# Altium schematic sheet 1_BlockDiagram.SchDoc
size A3
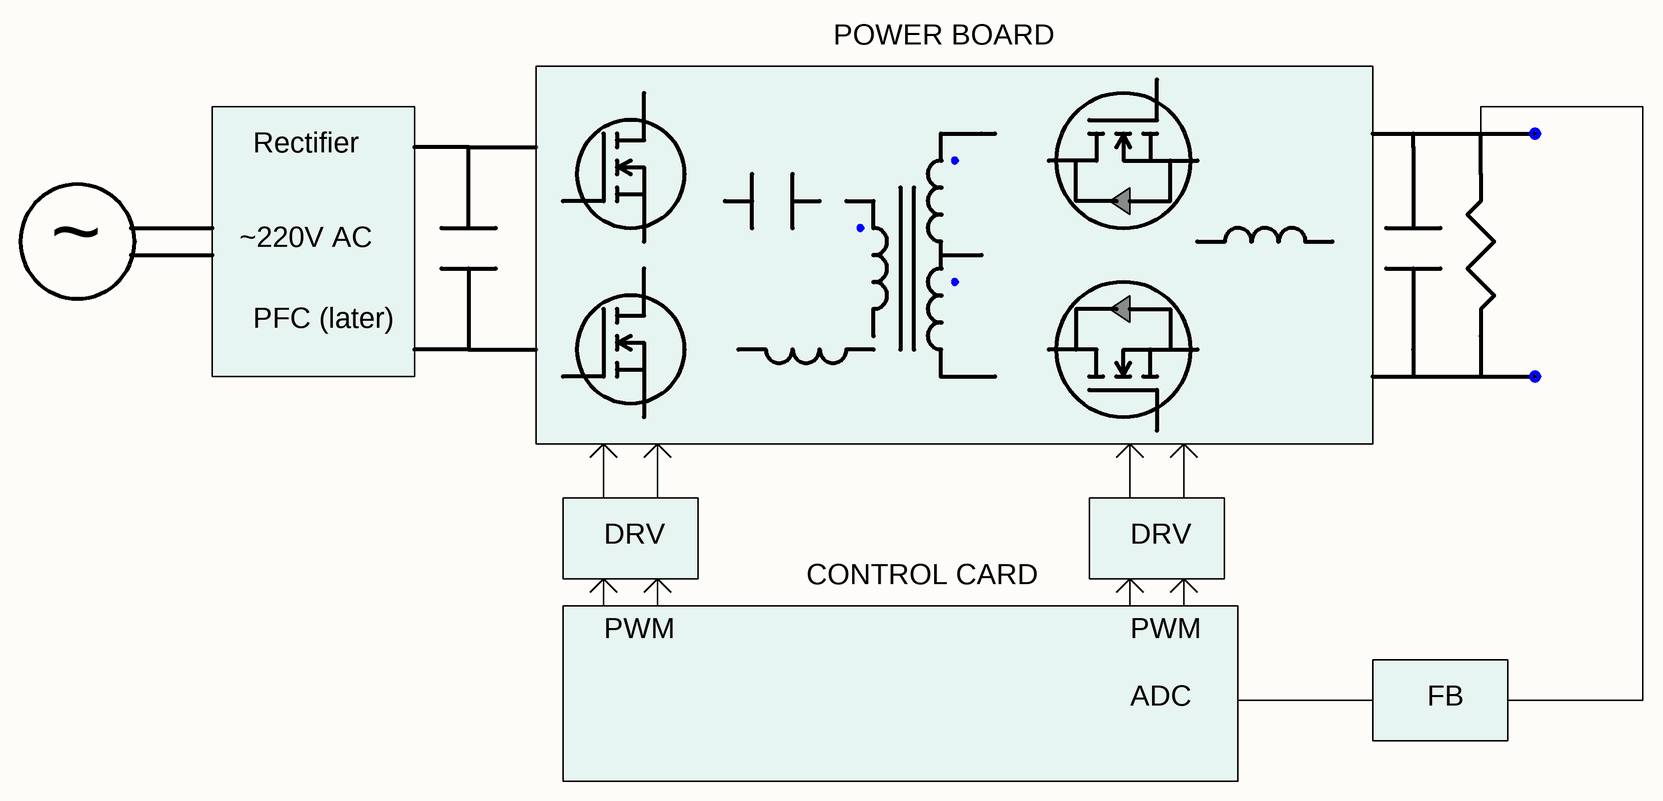
[diagram p0: 1_BlockDiagram.SchDoc]

## Notes on the sheet
- POWER BOARD
- Rectifier
- ~220V AC
- ~
- PFC (later)
- DRV
- CONTROL CARD
- PWM
- ADC
- FB
- Title:
- Project:
- Draw:
- Check:
- Revision:
- Sheet:
- of:
- File Name:
- Size:
- A3
- Modified Date:
- Time:
- Date: